# Altium schematic sheet APA102.SchDoc
size A4
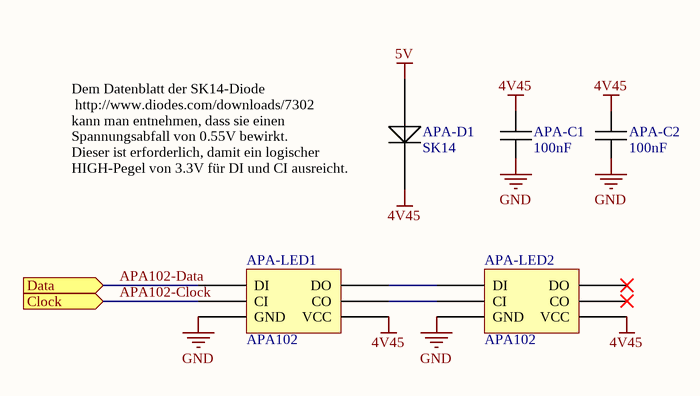
[diagram p0: APA102.SchDoc]

## Parts
APA-C1  100nF  [C 0805 wide]
APA-C2  100nF  [C 0805 wide]
APA-D1  SK14  [SC-90]
APA-LED1  APA102  [LED SMD 5x5mm]
APA-LED2  APA102  [LED SMD 5x5mm]

## Ports
Clock (in), Data (in)

## Nets
4V45: APA-C1.1 APA-C2.1 APA-D1.1 APA-LED1.4(VCC) APA-LED2.4(VCC)
5V: APA-D1.2
GND: APA-C1.2 APA-C2.2 APA-LED1.3(GND) APA-LED2.3(GND)
APA102-Clock: APA-LED1.2(CI) ; port Clock
APA102-Data: APA-LED1.1(DI) ; port Data
NetAPA-LED1_5: APA-LED1.5(CO) APA-LED2.2(CI)
NetAPA-LED1_6: APA-LED1.6(DO) APA-LED2.1(DI)

Not connected (* = marked no-connect by the designer): APA-LED2 5(CO)* 6(DO)*

## Notes on the sheet
- (near APA-D1) Dem Datenblatt der SK14-Diode
  http://www.diodes.com/downloads/7302
  kann man entnehmen, dass sie einen
  Spannungsabfall von 0.55V bewirkt.
  Dieser ist erforderlich, damit ein logischer
  HIGH-Pegel von 3.3V für DI und CI ausreicht.

## Library data of the parts
APA-C1 APA-C2 = Capacitor
APA-D1 = Diode